# Altium schematic sheet ThermocoupleFrontEnd.SchDoc
size A4; SheetNumber: 6; SheetTotal: 6
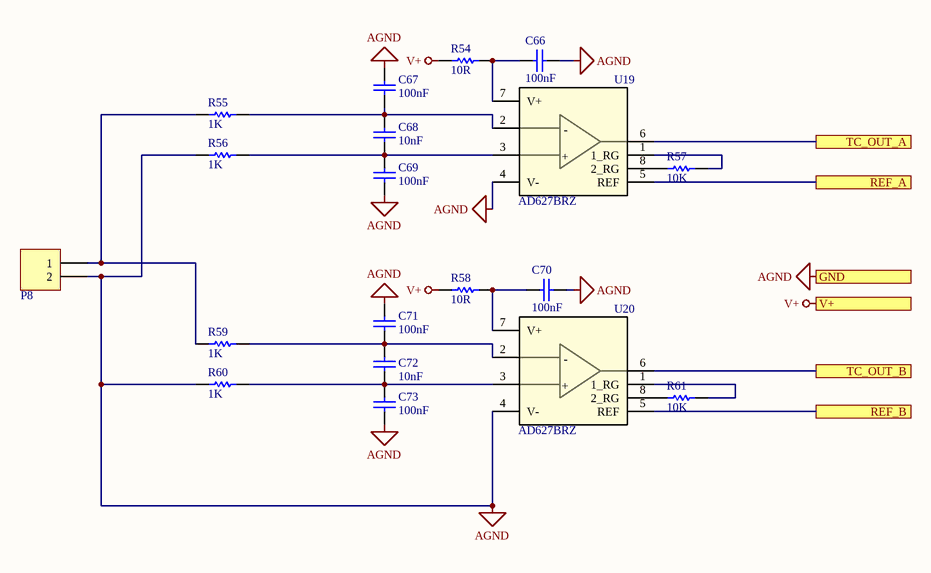
[diagram p0: ThermocoupleFrontEnd.SchDoc]

## Parts
C66  100nF  [R0603_C]
C67  100nF  [R0603_C]
C68  10nF  [R0603_C]
C69  100nF  [R0603_C]
C70  100nF  [R0603_C]
C71  100nF  [R0603_C]
C72  10nF  [R0603_C]
C73  100nF  [R0603_C]
P8  Header 2  [CP1X2]  (value not drawn)
R54  10R  [R0603_R]
R55  1K  [R0603_R]
R56  1K  [R0603_R]
R57  10K  [R0603_R]
R58  10R  [R0603_R]
R59  1K  [R0603_R]
R60  1K  [R0603_R]
R61  10K  [R0603_R]
U19  AD627BRZ  [SOP-8_150mil]
U20  AD627BRZ  [SOP-8_150mil]

## Ports
GND, REF_A, REF_B, TC_OUT_A, TC_OUT_B, V+

## Nets
AGND: C66.1 C67.1 C69.2 C70.1 C71.1 C73.2 P8.2 R56.1 R60.1 U19.4(V-) U20.4(V-) ; port GND
V+: R54.2 R58.2 ; port V+
REF_A: U19.5(REF) ; port REF_A
REF_B: U20.5(REF) ; port REF_B
TC_OUT_A: U19.6(VOUT) ; port TC_OUT_A
TC_OUT_B: U20.6(VOUT) ; port TC_OUT_B
NetC66_2: C66.2 R54.1 U19.7(V+)
NetC67_2: C67.2 C68.1 R55.2 U19.2(VIN-)
NetC68_2: C68.2 C69.1 R56.2 U19.3(VIN+)
NetC70_2: C70.2 R58.1 U20.7(V+)
NetC71_2: C71.2 C72.1 R59.2 U20.2(VIN-)
NetC72_2: C72.2 C73.1 R60.2 U20.3(VIN+)
NetP8_1: P8.1 R55.1 R59.1
NetR57_1: R57.1 U19.1(1_RG)
NetR57_2: R57.2 U19.8(2_RG)
NetR61_1: R61.1 U20.1(1_RG)
NetR61_2: R61.2 U20.8(2_RG)

## Notes on the sheet
- Page
- of
- (in symbol AD627BRZ) -; +

## Library data of the parts
C66 C67 C69-C71 C73 = 100nF/0603/50V: 精度 ±10% / 容值 100nF / 额定电压 50V / 温漂系数（介质材料) X7R; 厂家: FH(风华); 型号: 0603B104K500NT; 封装: 0603; 类型: Capacitor; 订货编码: C30926
C68 C72 = 10nF/0603/C0G/50V: 精度 ±5% / 容值 10nF / 额定电压 50V / 温漂系数（介质材料) C0G; 厂家: FH(风华); 型号: 0603CG103J500NT; 封装: 0603; 类型: Capacitor; 订货编码: C82282
P8 = Header 2: Header, 2-Pin; 厂家: /; System: Connector; 型号: /; 封装: /; 类型: /; 订货编码: /
R54 R58 = 10R/0603: 精度 ±1% / 阻值 10Ω / 温度系数 ±100ppm/℃ / 功率 0.1W; 厂家: FH(风华); 型号: RS-03K10R0FT; 类型: Resistor; 订货编码: C136596; 封装: 0603
R55 R56 R59 R60 = 1K/0603: 精度 ±1% / 温度系数 ±100ppm/℃ / 阻值 1kΩ / 功率 0.1W; 厂家: FH(风华); 型号: RS-03K1001FT; 类型: Resistor; 订货编码: C115325; 封装: 0603
R57 R61 = 10K/0603: 精度 ±1% / 温度系数 ±100ppm/℃ / 阻值 10kΩ / 功率 0.1W; 厂家: FH(风华); 型号: RS-03K1002FT; 类型: Resistor; 订货编码: C115324; 封装: 0603
U19 U20 = AD627BRZ: 增益带宽积（GBP） 80kHz(-3dB) / 放大器组数 1 / 输出类型 Rail-to-Rail / 运放类型 Instrumentation / 各通道功耗 - / 压摆率（SR） 0.06 V/us / 工作温度 -40℃~85℃ / 电源电压 2.2V ~ 36V, ±1.1V ~ 18V; 厂家: TI(德州仪器); 封装: SOIC-8_150mil; 类型: 运放; 订货编码: C19137; 型号: AD627BRZ